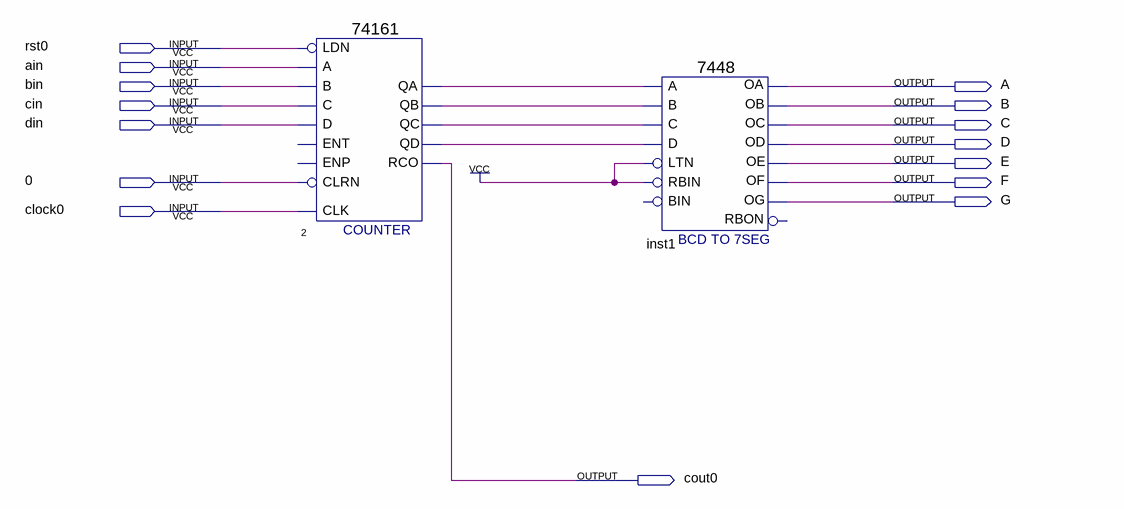
[diagram p0: schematic sheet]
// Quartus schematic 6.bdf as structural Verilog: 2 symbols, 15 pins
module \6  (
  input  rst0,
  input  ain,
  input  bin,
  input  cin,
  input  din,
  input  \0 ,
  input  clock0,
  output A,
  output B,
  output C,
  output D,
  output E,
  output F,
  output G,
  output cout0
);

  wire n2_qa, n2_qb, n2_qc, n2_qd;

  \74161  u_2 (
    .CLRN(\0 ), .CLK(clock0), .LDN(rst0), .A(ain), .D(din), .B(bin), .C(cin), .QD(n2_qd), .QC(n2_qc),
    .QB(n2_qb), .QA(n2_qa), .RCO(cout0));  // open: ENP, ENT
  \7448  inst1 (
    .A(n2_qa), .C(n2_qc), .D(n2_qd), .B(n2_qb), .RBIN(1'b1), .LTN(1'b1), .OC(C), .OE(E), .OD(D), .OF(F),
    .OG(G), .OB(B), .OA(A));  // open: BIN, RBON
endmodule
